# EAGLE design ISRelayV12 (EAGLE 6.3)
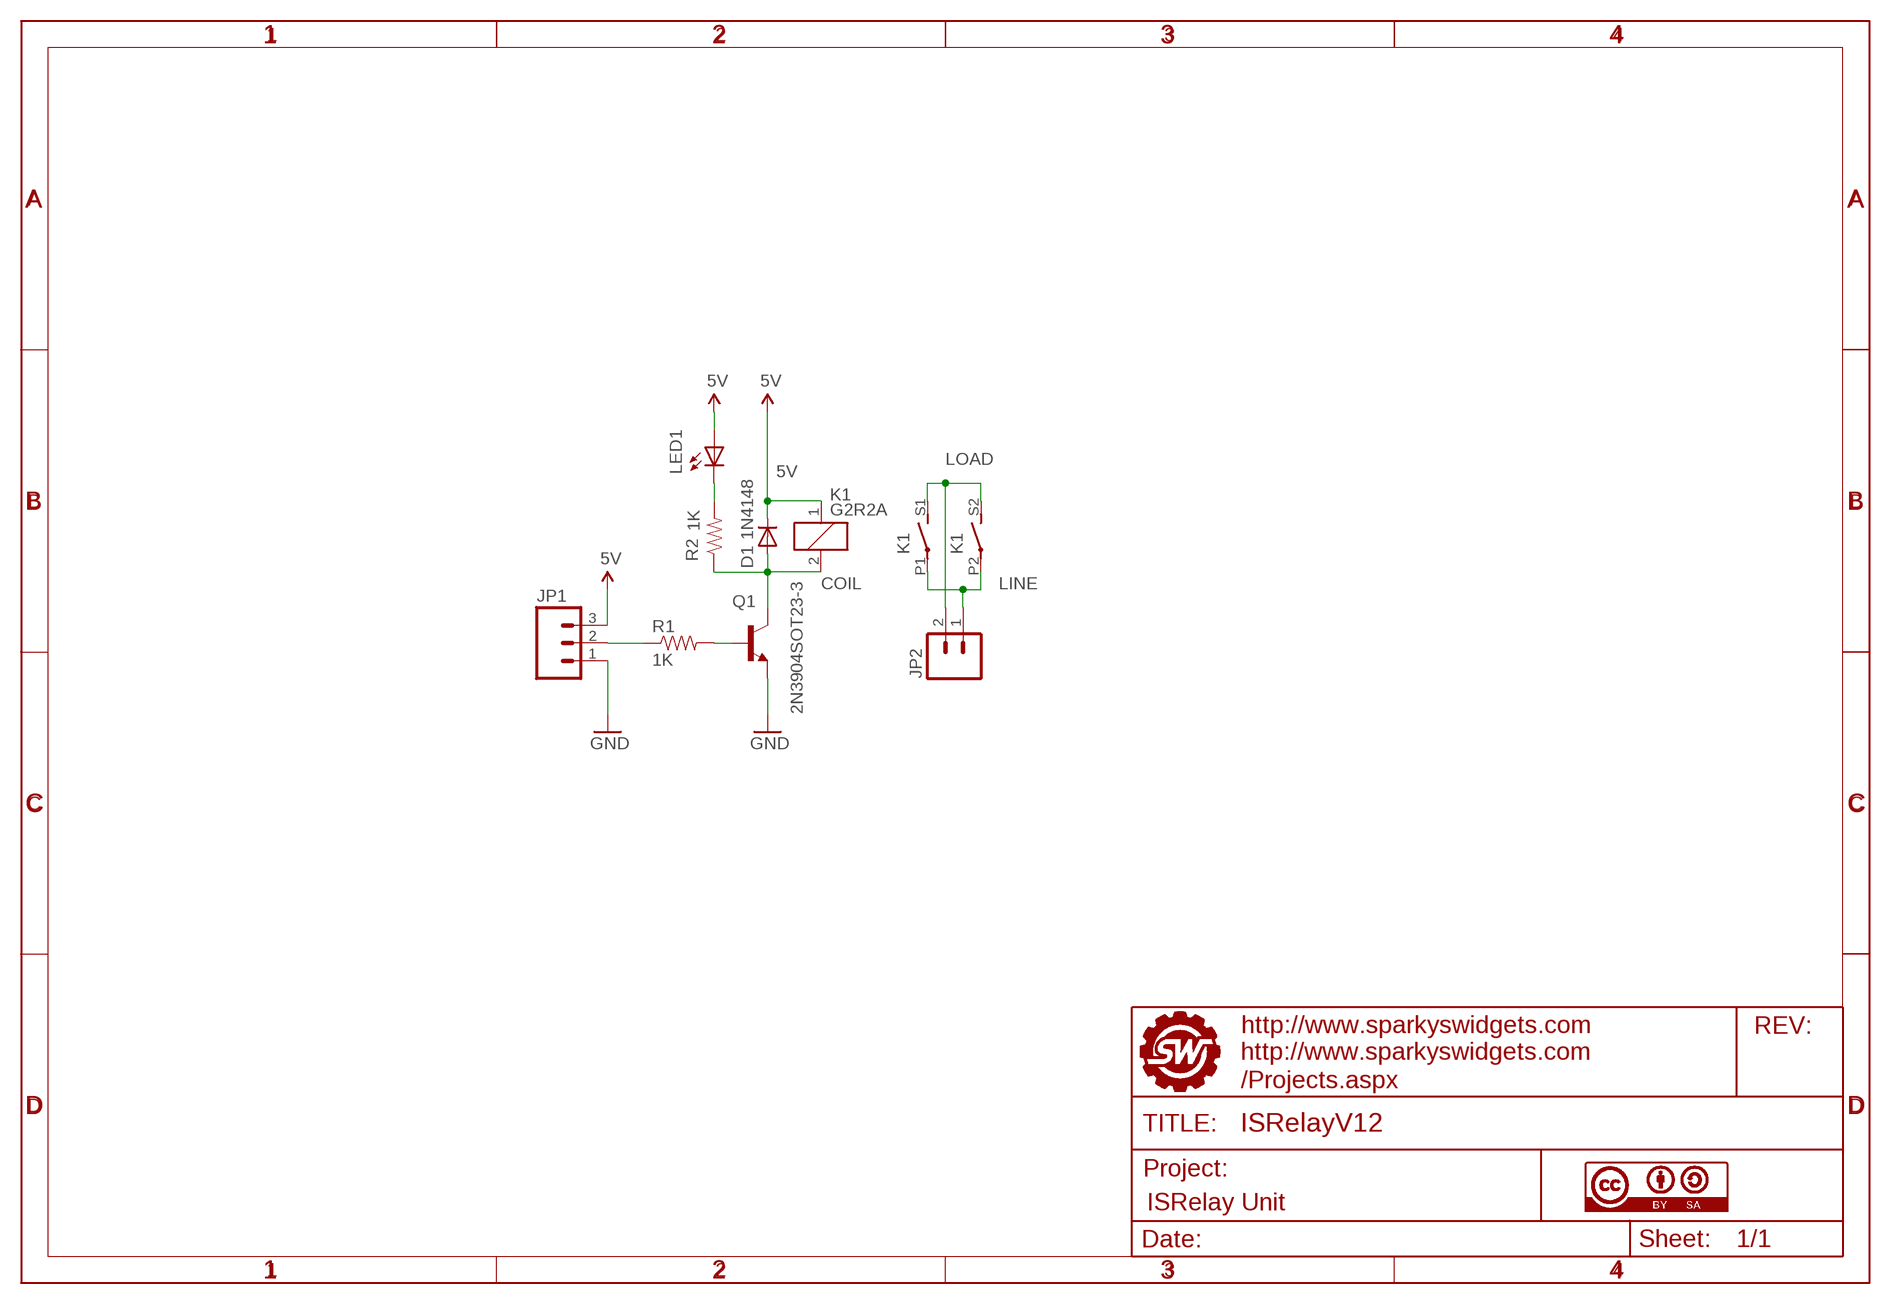
[diagram p0: schematic, sheet 1]

## Parts
D1  1N4148  MBR0520LT  [SOD123]
JP1  M03SCREW  [SCREWTERMINAL-3.5MM-3]
JP2  M025MM  [SCREWTERMINAL-5MM-2]
K1  G2R2A  [G2R2A]
LED1  LEDCHIP-LED0805  [CHIP-LED0805]
Q1  2N3904SOT23-3  [SOT-23]
R1  1K  RESISTOR0805-RES  [0805]
R2  1K  RESISTOR0805-RES  [0805]
U$9  CC-BY-SA  [CC-BY-SA]
U$11  FRAME_SW_LOGO_CC_BY_SA  [SWPCBLOGOWITHINFO]

## Nets
5V: D1.C JP1.3 K1.1 LED1.A
COIL: D1.A K1.2 Q1.1(C) R2.1
GND: JP1.1 Q1.2(E)
LINE: JP2.1 K1.P1(2:P) K1.P2(3:P)
LOAD: JP2.2 K1.S1(2:S) K1.S2(3:S)
N$2: Q1.3(B) R1.2
N$4: LED1.C R2.2
RELAY: JP1.2 R1.1

## Library data of the parts
D1 = SparkysWidgets:MBR0520LT: SCHOTTKY BARRIER RECTIFIER Source: http://onsemi.com .. MBR0520LT1-D.pdf
JP1 = SparkFun:M03: Header 3 Standard 3-pin 0.1" header. Use with straight break away headers (SKU : PRT-00116), right angle break away headers (PRT-00553), swiss pins (PRT-00743), machine pins (PRT-00117), and female headers (PRT-00115). Molex polarized connector foot print use with SKU : PRT-08232 with associated crimp pins and housings.
JP2 = SparkFun:M02: Header 2 Standard 2-pin 0.1" header. Use with straight break away headers (SKU : PRT-00116), right angle break away headers (PRT-00553), swiss pins (PRT-00743), machine pins (PRT-00117), and female headers (PRT-00115). Molex polarized connector foot print use with SKU : PRT-08233 with associated crimp pins and housings.
K1 = relay:G2R2A: RELAY 2 x norm. open, Omron; MPN: G2R-2A-DC24; OC_FARNELL: 6985269; OC_NEWARK: 36M5257
LED1 = led:LED: LED OSRAM: - CHIPLED LG R971, LG N971, LY N971, LG Q971, LY Q971, LO R971, LY R971 LH N974, LH R974 LS Q976, LO Q976, LY Q976 LO Q996 - Hyper CHIPLED LW Q18S LB Q993, LB Q99A, LB R99A - SideLED LS A670, LO A670, LY A670, LG A670, LP A670 LB A673, LV A673, LT A673, LW A673 LH A674 LY A675 LS A676, LA A676, LO A676, LY A676, LW A676 LS A679, LY A679, LG A679 - Hyper Micro SIDELED® LS Y876, LA Y876, LO Y876, LY Y876 LT Y87S - SmartLED LW L88C, LW L88S LB L89C, LB L89S, LG L890 LS L89K, LO L89K, LY L89K LS L896, LA L896, LO L896, LY L896 - TOPLED LS T670, LO T670, LY T670, LG T670, LP T670 LSG T670, LSP T670, LSY T670, LOP T670, LYG T670 LG T671, LOG T671, LSG T671 LB T673, LV T673, LT T673, LW T673 LH T674 LS T676, LA T676, LO T676, LY T676, LB T676, LH T676, LSB T676, LW T676 LB T67C, LV T67C, LT T67C, LS T67K, LO T67K, LY T67K, LW E67C LS E67B, LA E67B, LO E67B, LY E67B, LB E67C, LV E67C, LT E67C LW T67C LS T679, LY T679, LG T679 LS T770, LO T770, LY T770, LG T770, LP T770 LB T773, LV T773, LT T773, LW T773 LH T774 LS E675, LA E675, LY E675, LS T675 LS T776, LA T776, LO T776, LY T776, LB T776 LHGB T686 LT T68C, LB T68C - Hyper Mini TOPLED® LB M676 - Mini TOPLED Santana® LG M470 LS M47K, LO M47K, LY M47K Source: http://www.osram.convergy.de LUXEON: - LUMILED® LXK2-PW12-R00, LXK2-PW12-S00, LXK2-PW14-U00, LXK2-PW14-V00 LXK2-PM12-R00, LXK2-PM12-S00, LXK2-PM14-U00 LXK2-PE12-Q00, LXK2-PE12-R00, LXK2-PE12-S00, LXK2-PE14-T00, LXK2-PE14-U00 LXK2-PB12-K00, LXK2-PB12-L00, LXK2-PB12-M00, LXK2-PB14-N00, LXK2-PB14-P00, LXK2-PB14-Q00 LXK2-PR12-L00, LXK2-PR12-M00, LXK2-PR14-Q00, LXK2-PR14-R00 LXK2-PD12-Q00, LXK2-PD12-R00, LXK2-PD12-S00 LXK2-PH12-R00, LXK2-PH12-S00 LXK2-PL12-P00, LXK2-PL12-Q00, LXK2-PL12-R00 Source: www.luxeon.com KINGBRIGHT: KA-3528ASYC Source: www.kingbright.com
Q1 = SparkysWidgets:2N3904: NPN Transistor
R1 R2 = SparkysWidgets:RESISTOR: Resistor Basic schematic elements and footprints for 0603, 1206, and PTH resistors.
U$9 = SparkysWidgets:CC-BY-SA
U$11 = SparkysWidgets:FRAME_SW_LOGO_CC_BY_SA: A4 Sparky's Widgets frame This is a standard A4 Frame, the Doc Field has been modified with our Logo and contains the license and extra project information!; PROJECT: ISRelay Unit; URL1: /Projects.aspx; URLHOME: http://www.sparkyswidgets.com; URLPROJECT: http://www.sparkyswidgets.com

## Board
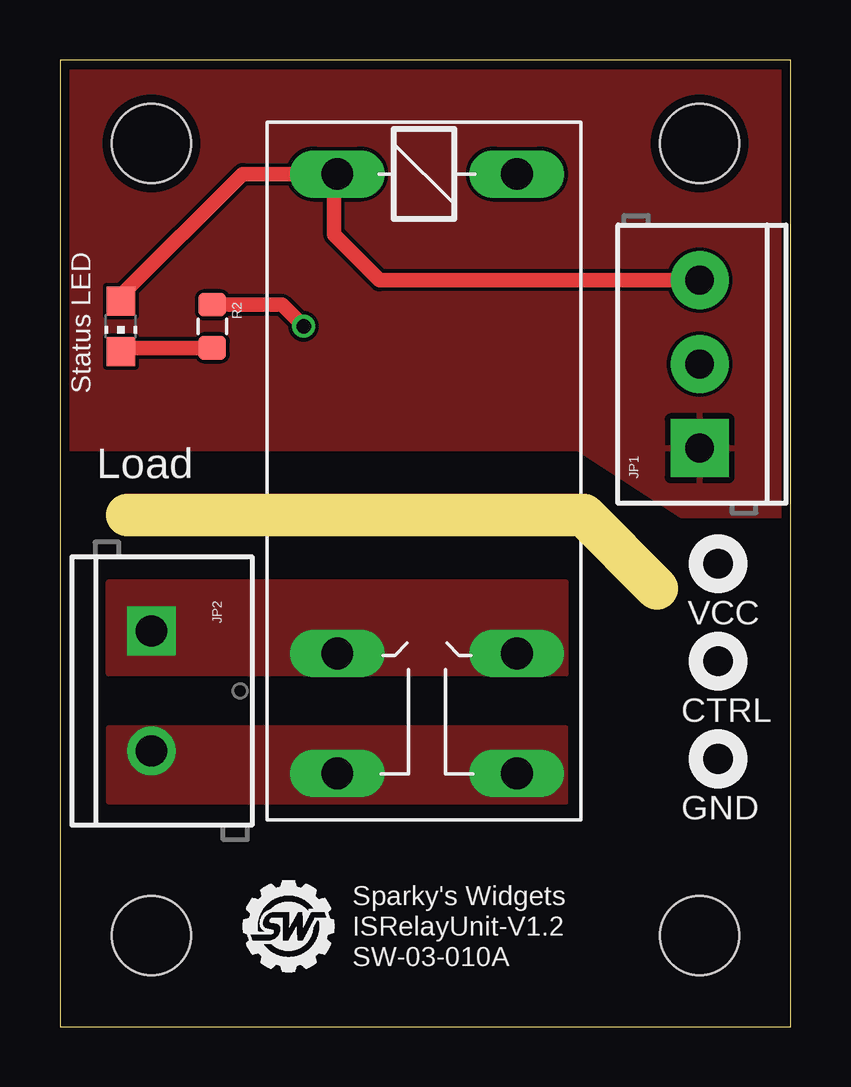
[diagram p1: board, top side]
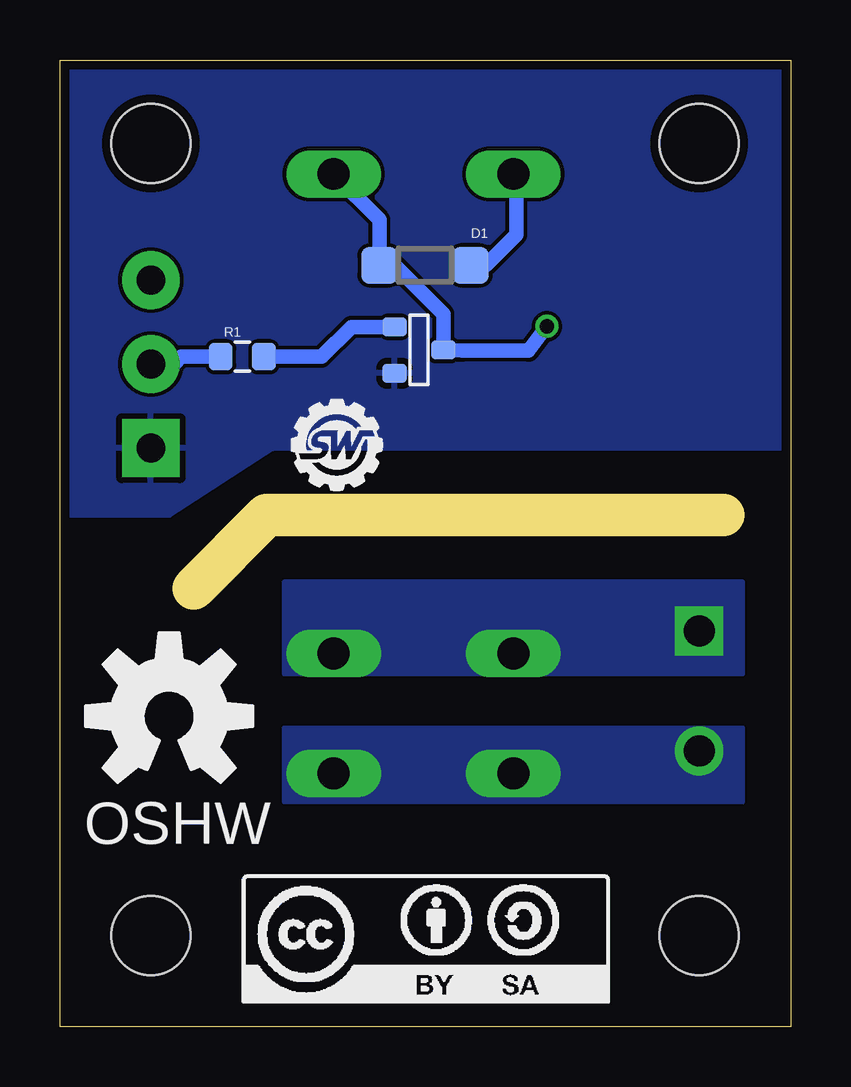
[diagram p2: board, bottom side, seen from below]

Size 30.46 x 40.31 mm. Coordinates in mm from the lower left corner, seen from the top.
Outline: 2.79,21.34 21.84,21.34 24.89,18.29
Outline: 0,0 30.46,0 30.46,40.31 0,40.31 0,0
Copper layers (1*16): Top 0.0356mm / dielectric 1.5011mm / Bottom 0.0356mm
Design rules "LaenPCBOrder": minimum track width 6mil, minimum drill 13mil, track to track 6mil, track to pad 6mil, pad to pad 6mil, via to via 6mil, smd to smd 6mil, copper to edge 15mil, drill to drill 6mil, minimum pad ring 7mil, minimum via ring 7mil, stop-mask expansion 4mil, vias tented up to drill 0mil, thermal gap 10mil

### Footprints (pad centres in the part's own frame; a part is rotated, then mirrored left to right if it is on the bottom)
SOD123 = smd 1.524 x 1.524: A 1.9,0; C -1.9,0
SCREWTERMINAL-3.5MM-3 = drill 1.2 pad 2.413 square: 1 0,0 | drill 1.2 pad 2.413: 2 3.5,0; 3 7,0
SCREWTERMINAL-5MM-2 = drill 1.3 pad 2.032 square: 1 0,0 | drill 1.3 pad 2.032: 2 5,0
G2R2A = drill 1.321 long: 1 -2.54,-3.683; 2 -2.54,3.81; P1 17.45,3.81; P2 17.45,-3.683; S1 22.454,3.81; S2 22.454,-3.683
CHIP-LED0805 = smd 1.2 x 1.2: A 0,-1.05; C 0,1.05
SOT-23 = smd 0.787 x 1.016: 1 0.025,-1.016; 2 -0.94,1.016; 3 0.991,1.016
0805 = smd 0.984 x 1.143: 1 -0.9,0; 2 0.9,0
STAND-OFF = hole 3.302: 0,0

### Placement (x,y rotation side)
D1  15.24,31.75 180 bottom
JP1  26.67,24.13 90 top
JP2  3.81,16.51 270 top
K1  15.24,33.02 270 top
LED1  2.54,29.21 180 top
Q1  15.49,28.19 90 bottom
R1  22.86,27.94 0 bottom
R2  6.35,29.21 270 top
U$4  [STAND-OFF]  3.81,36.83 0 top
U$5  [STAND-OFF]  26.67,36.83 0 top
U$6  [STAND-OFF]  26.67,3.81 0 top
U$7  [STAND-OFF]  3.81,3.81 0 top
U$8  [SWPCBLOGO]  7.62,2.29 0 top
U$9  22.86,1.02 0 bottom
U$10  [OSHW-LOGO-L]  25.91,12.95 0 bottom
U$11  20.83,22.35 0 bottom

### Tracks (layer width: path | path; a pad name or v marks a point on that pad's centre or on a via)
5V
  Top 0.61: LED1.A 2.54,30.48 7.62,35.56 K1.1 11.43,35.43 11.43,33.02 13.32,31.13 JP1.3
  Bottom 0.61: D1.C 12.7,31.75 11.43,33.02 11.43,35.43 K1.1
COIL  (via drill 0.6)
  Top 0.61: R2.1 9.26,30.11 v10.16,29.21
  Bottom 0.61: v10.16,29.21 10.92,28.19 13.69,28.19 Q1.1 14.48,29.72 16.51,31.75 D1.A 17.14,33.65 K1.2
GND
  pour Top: 0,43.18 0,24.13 21.59,24.13 25.91,21.34 34.29,21.34 34.29,43.18
  pour Bottom: 0,43.18 0,24.13 21.59,24.13 25.91,21.34 34.29,21.34 34.29,43.18
LINE
  pour Bottom (no thermals): 21.08,14.73 21.08,18.54 2.03,18.54 2.03,14.73
  pour Top (no thermals): 2.03,14.73 2.03,18.54 21.08,18.54 21.08,14.73
LOAD
  pour Top (no thermals): 2.03,12.45 2.03,9.4 21.08,9.4 21.08,12.45
  pour Bottom (no thermals): 2.03,12.45 2.03,9.4 21.08,9.4 21.08,12.45
N$2
  Bottom 0.61: R1.2 19.56,27.94 18.31,29.18 Q1.3
N$4
  Top 0.61: R2.2 2.69,28.31 LED1.C
RELAY
  Bottom 0.61: JP1.2 25.71,27.63 25.4,27.94 R1.1

### Text on the board
tPlace: Status LED | Load | VCC | CTRL | GND | Sparky's Widgets | ISRelayUnit-V1.2 | SW-03-010A
bPlace: OSHW